# EAGLE design synth-zodiac-leo-power (EAGLE 9.6.2)
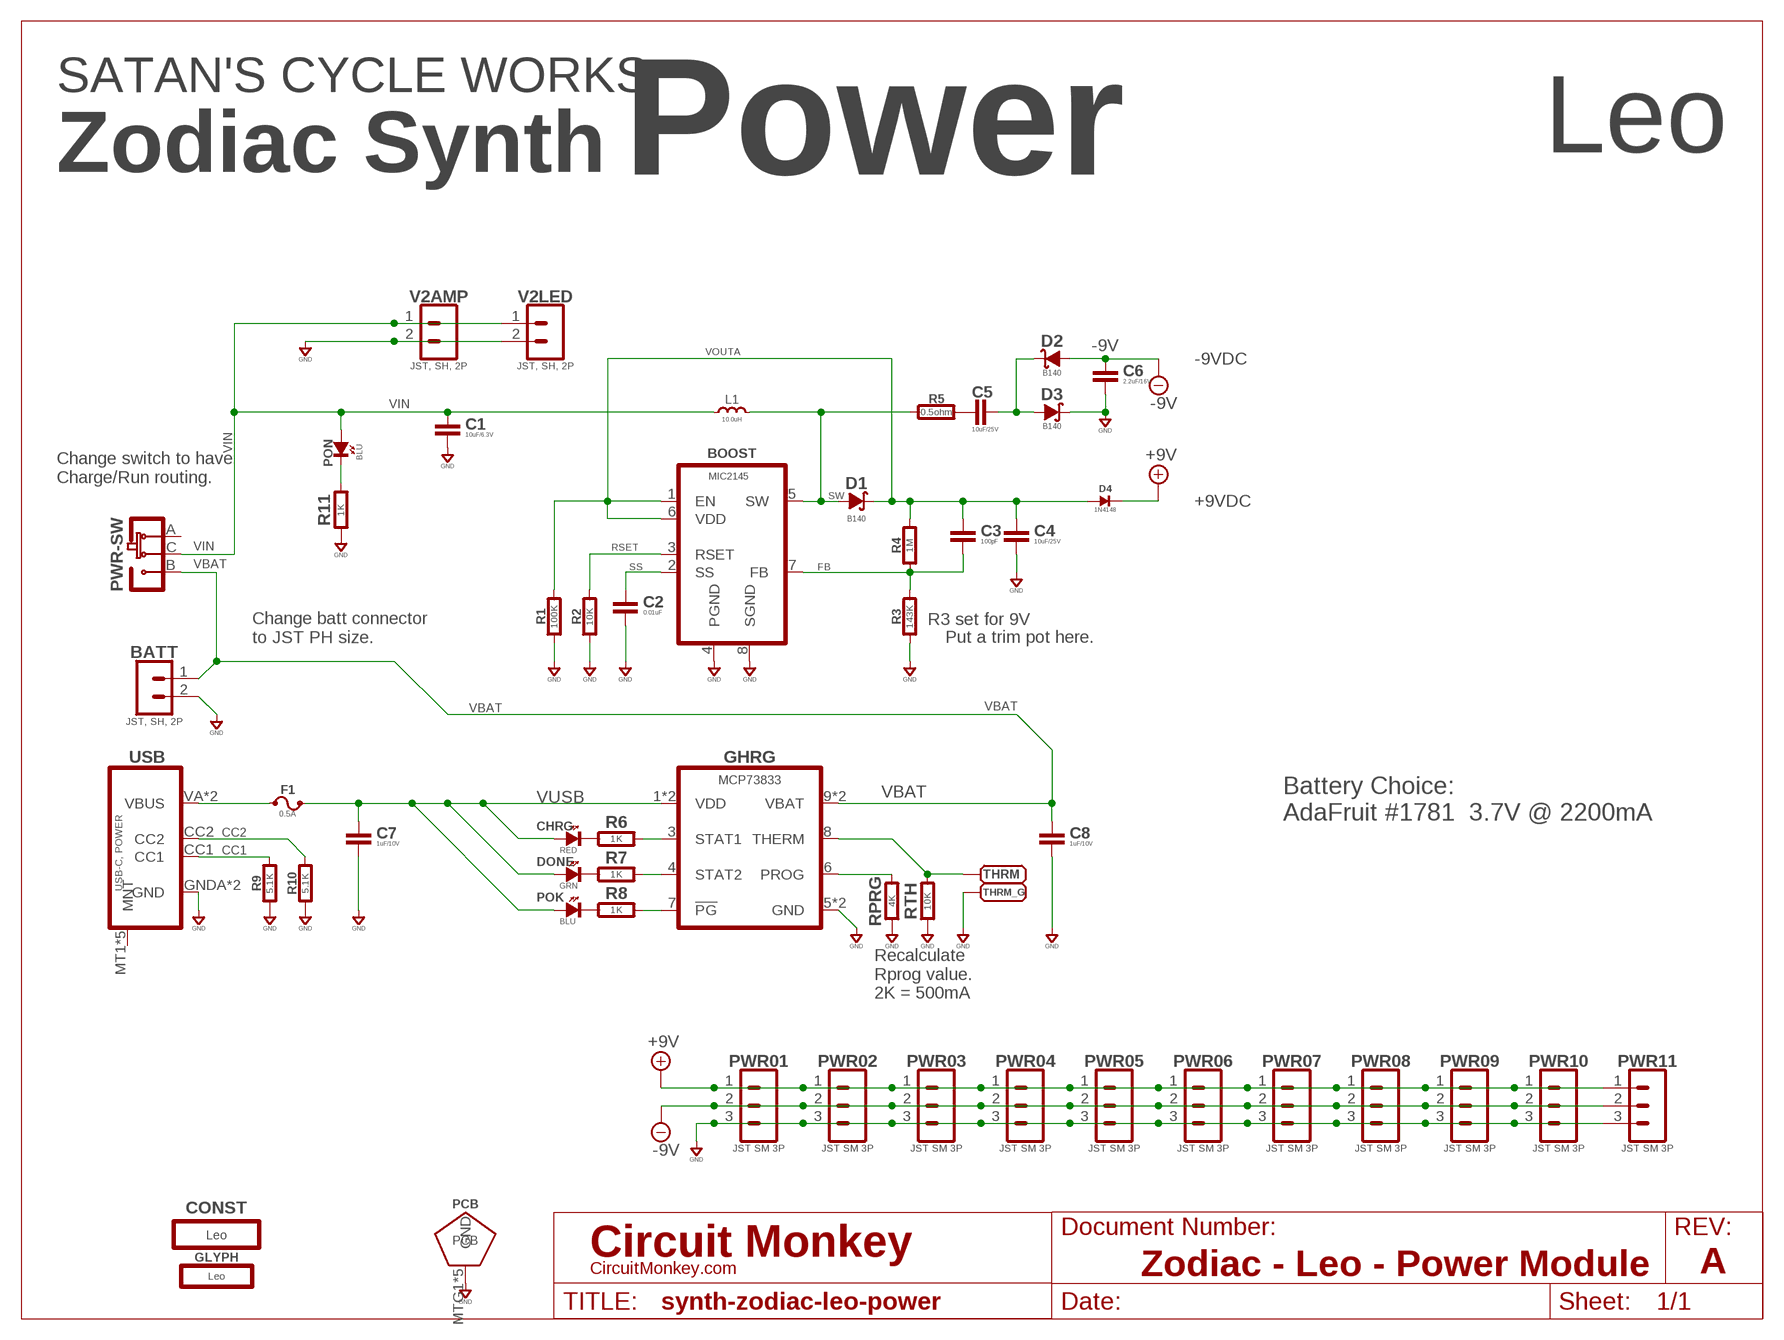
[diagram p0: schematic, sheet 1]
U$1 (LETTER_L-CIRCUITMONKEY): DOCUMENT_NUMBER: Zodiac - Leo - Power Module; REV: A

## Parts
BATT  JST, SH, 2P  02P-SM-VT-SMT  [BM02B-SRSS-TB]
BOOST  MIC2145  BOOST-MIC2145-MSOP  [MSOP8-0.65]
C1  10uF/6.3V  CAPACITOR0603  [0603-CAP]
C2  0.01uF  CAPACITOR0603  [0603-CAP]
C3  100pF  CAPACITOR0603  [0603-CAP]
C4  10uF/25V  CAPACITOR0603  [0603-CAP]
C5  10uF/25V  CAPACITOR0603  [0603-CAP]
C6  2.2uF/16V  CAPACITOR0603  [0603-CAP]
C7  1uF/10V  CAPACITOR0603  [0603-CAP]
C8  1uF/10V  CAPACITOR0603  [0603-CAP]
CHRG  RED  SMT0603  [SMD_0603]
CONST  Leo  CONSTELLATION-LEO  [LEO-CONST]
D1  B140  SCHOTTKYB140  [SMA]
D2  B140  SCHOTTKYB140  [SMA]
D3  B140  SCHOTTKYB140  [SMA]
D4  1N4148  DIODE-1N4148  [SOD-123]
DONE  GRN  SMT0603  [SMD_0603]
F1  0.5A  FUSEBOURNS-MF-MSMF  [BOURNS-MF-MSMF]
GHRG  MCP73833  MCP73833-DFN  [DFN-10-3X3]
GLYPH  Leo  GLYPH-LEO  [LEO-GLYPH]
L1  10.0uH  INDUCTORSMD-05X04MM  [IND-SRN5040]
PCB  PCB FAB  PENTAGON-40R  [PENTAGON-40MM-RAD]
POK  BLU  SMT0603  [SMD_0603]
PON  BLU  SMT0603  [SMD_0603]
PWR  SLIDE-SPDT-MNTSS-12-F45-TH-PCB-2  [SS-12-F45-PNL-SMT-2]
PWR01  JST SM 3P  03P-SM-VT-SMT  [BM03B-SRSS-TB]
PWR02  JST SM 3P  03P-SM-VT-SMT  [BM03B-SRSS-TB]
PWR03  JST SM 3P  03P-SM-VT-SMT  [BM03B-SRSS-TB]
PWR04  JST SM 3P  03P-SM-VT-SMT  [BM03B-SRSS-TB]
PWR05  JST SM 3P  03P-SM-VT-SMT  [BM03B-SRSS-TB]
PWR06  JST SM 3P  03P-SM-VT-SMT  [BM03B-SRSS-TB]
PWR07  JST SM 3P  03P-SM-VT-SMT  [BM03B-SRSS-TB]
PWR08  JST SM 3P  03P-SM-VT-SMT  [BM03B-SRSS-TB]
PWR09  JST SM 3P  03P-SM-VT-SMT  [BM03B-SRSS-TB]
PWR10  JST SM 3P  03P-SM-VT-SMT  [BM03B-SRSS-TB]
PWR11  JST SM 3P  03P-SM-VT-SMT  [BM03B-SRSS-TB]
R1  100K  RESISTOR0603  [0603-RES]
R2  10K  RESISTOR0603  [0603-RES]
R3  143K  RESISTOR0603  [0603-RES]
R4  1M  RESISTOR0603  [0603-RES]
R5  0.5ohm  RESISTOR0603  [0603-RES]
R6  1K  RESISTOR0603  [0603-RES]
R7  1K  RESISTOR0603  [0603-RES]
R8  1K  RESISTOR0603  [0603-RES]
R9  5.1K  RESISTOR0603  [0603-RES]
R10  5.1K  RESISTOR0603  [0603-RES]
R11  1K  RESISTOR0603  [0603-RES]
RPRG  4K  RESISTOR0603  [0603-RES]
RTH  10K  RESISTOR0603  [0603-RES]
THRM  PADSMD-050X050  [SMD-050X050]
THRM_G  PADSMD-050X050  [SMD-050X050]
USB  USB-C, POWER  USB-C-PWRGCT-4515  [GCT-USB4515-PANEL]
V2AMP  JST, SH, 2P  02P-SM-VT-SMT  [BM02B-SRSS-TB]
V2LED  JST, SH, 2P  02P-SM-VT-SMT  [BM02B-SRSS-TB]

## Nets
+9V: D4.K PWR01.1 PWR02.1 PWR03.1 PWR04.1 PWR05.1 PWR06.1 PWR07.1 PWR08.1 PWR09.1 PWR10.1 PWR11.1
-9V: C6.1 D2.A PWR01.2 PWR02.2 PWR03.2 PWR04.2 PWR05.2 PWR06.2 PWR07.2 PWR08.2 PWR09.2 PWR10.2 PWR11.2
CC1: R9.2 USB.CC1
CC2: R10.2 USB.CC2
FB: BOOST.7(FB) C3.2 R3.2 R4.1
GND: BATT.2 BOOST.4(PGND) BOOST.8(SGND) C1.2 C2.2 C4.2 C6.2 C7.2 C8.2 D3.K GHRG.5(GND) GHRG.PAD(GND) PCB.MTG1(GND) PCB.MTG2(GND) PCB.MTG3(GND) PCB.MTG4(GND) PCB.MTG5(GND) PWR01.3 PWR02.3 PWR03.3 PWR04.3 PWR05.3 PWR06.3 PWR07.3 PWR08.3 PWR09.3 PWR10.3 PWR11.3 R1.1 R2.1 R3.1 R9.1 R10.1 R11.1 RPRG.1 RTH.1 THRM_G.1(PAD) USB.GNDA(GND) USB.GNDB(GND) V2AMP.2 V2LED.2
N$1: C5.1 R5.2
N$2: C5.2 D2.K D3.A
N$3: CHRG.K(C) R6.1
N$4: PON.K(C) R11.2
N$5: DONE.K(C) R7.1
N$7: POK.K(C) R8.1
N$8: GHRG.6(PROG) RPRG.2
N$9: GHRG.3(STAT1) R6.2
N$10: GHRG.4(STAT2) R7.2
N$11: GHRG.7(!PG) R8.2
N$12: GHRG.8(THERM) RTH.2 THRM.1(PAD)
RSET: BOOST.3(RSET) R2.2
SS: BOOST.2(SS) C2.1
SW: BOOST.5(SW) D1.A L1.1 R5.1
VBAT: BATT.1 C8.1 GHRG.9(VBAT) GHRG.10(VBAT) PWR.B(-SW:B)
VBUS: F1.1 USB.VA(VBUS) USB.VB(VBUS)
VIN: C1.1 L1.2 PON.A PWR.C(-SW:C) V2AMP.1 V2LED.1
VOUTA: BOOST.1(EN) BOOST.6(VDD) C3.1 C4.1 D1.K D4.A R1.2 R4.2
VUSB: C7.1 CHRG.A DONE.A F1.2 GHRG.1(VDD) GHRG.2(VDD) POK.A
Unconnected: PWR.A(-SW:A) PWR.MTG1(-MTG:MT1) PWR.MTG2(-MTG:MT2) PWR.MTG3(-MTG:MT1) PWR.MTG4(-MTG:MT2) USB.MT1(MNT) USB.MT2(MNT) USB.MT3(MNT) USB.MT4(MNT) USB.MTC(MNT)

## Notes on the sheet
- Power | Leo
- SATAN'S CYCLE WORKS
- Zodiac Synth
- -9VDC
- Change switch to have 
  Charge/Run routing.
- +9VDC
- R3 set for 9V
- Change batt connector
  to JST PH size.
- Put a trim pot here.
- Battery Choice:
  AdaFruit #1781  3.7V @ 2200mA
- Recalculate
  Rprog value.
  2K = 500mA

## Library data of the parts
BATT V2AMP V2LED = con-jst:02P: 2 pin connector; COST01: 0.45; COST10: 0.4; COST100: 0.35; MFR: JST; MPN: BMB02B-SRSS-TB
BOOST = regulators:BOOST-MIC2145: Micrel 2145 Boost Converter; COST01: 2.75; COST10: 2.71; COST100: 2.70; MFR: Micrel; MPN: MIC2145YMM
C1-C8 = rlc:CAPACITOR: Capacitor; COST01: 0.12; COST10: 0.09; COST100: 0.05
CHRG DONE POK PON = led:SMT: LED SMT; COST01: 0.20; COST10: 0.17; COST100: 0.14
CONST = circuit-monkey-zodiac:CONSTELLATION: Constellations
D1-D3 = diodes:SCHOTTKY: Schottky Diodes; COST01: 0.38; COST10: 0.28; COST100: 0.18; MFR: Vishay/Various; MPN: B140
D4 = diodes:DIODE-: Diode; COST01: 0.20; COST10: 0.18; COST100: 0.10; MPN: 1N4148W
F1 = fuse:FUSE: Fuse; COST01: 0.75; COST10: 0.60; COST100: 0.50; MFR: BOURNS; MPN: MF-MSMF*
GHRG = co-microchip:MCP73833: USB Charger for Li-Ion Battery cell.; MFR: Microchip; MPN: MCP73833-AMI/MF
GLYPH = circuit-monkey-zodiac:GLYPH: Glyph
L1 = rlc:INDUCTOR: Inductor; COST01: 0.55; COST10: 0.40; COST100: 0.35; MFR: Bourns; MPN: SRN5040
PCB = circuit-monkey-zodiac:PENTAGON: Pentagram shaped PCB
PWR = switch-thd:SLIDE-SPDT-MNT: Slide Switch, SPDT; COST01: 0.15; COST10: 0.12; COST100: 0.12; MFR: Tayda; MPN: A-659/A-5111/A-5104
PWR01-PWR09 PWR10 PWR11 = con-jst:03P: 3 pin connector; COST01: 0.60; COST10: 0.45; COST100: 0.38; MFR: JST; MPN: BM03B-SRSS-TB
R1-R11 RPRG RTH = rlc:RESISTOR: Resistor; COST01: 0.10; COST10: 0.05; COST100: 0.02
THRM THRM_G = con-testpoints:PAD: Solder Pad
USB = con-usb:USB-C-PWR: USB-C, Power Only; COST01: 0.70; COST10: 0.55; COST100: 0.45; MFR: GCT; MPN: USB4515

## Net classes
0 default: width 0.152 mm, clearance 0.152 mm
2 gnd: width 0.203 mm, drill 0.33 mm, clearance 0.152 mm

## Board
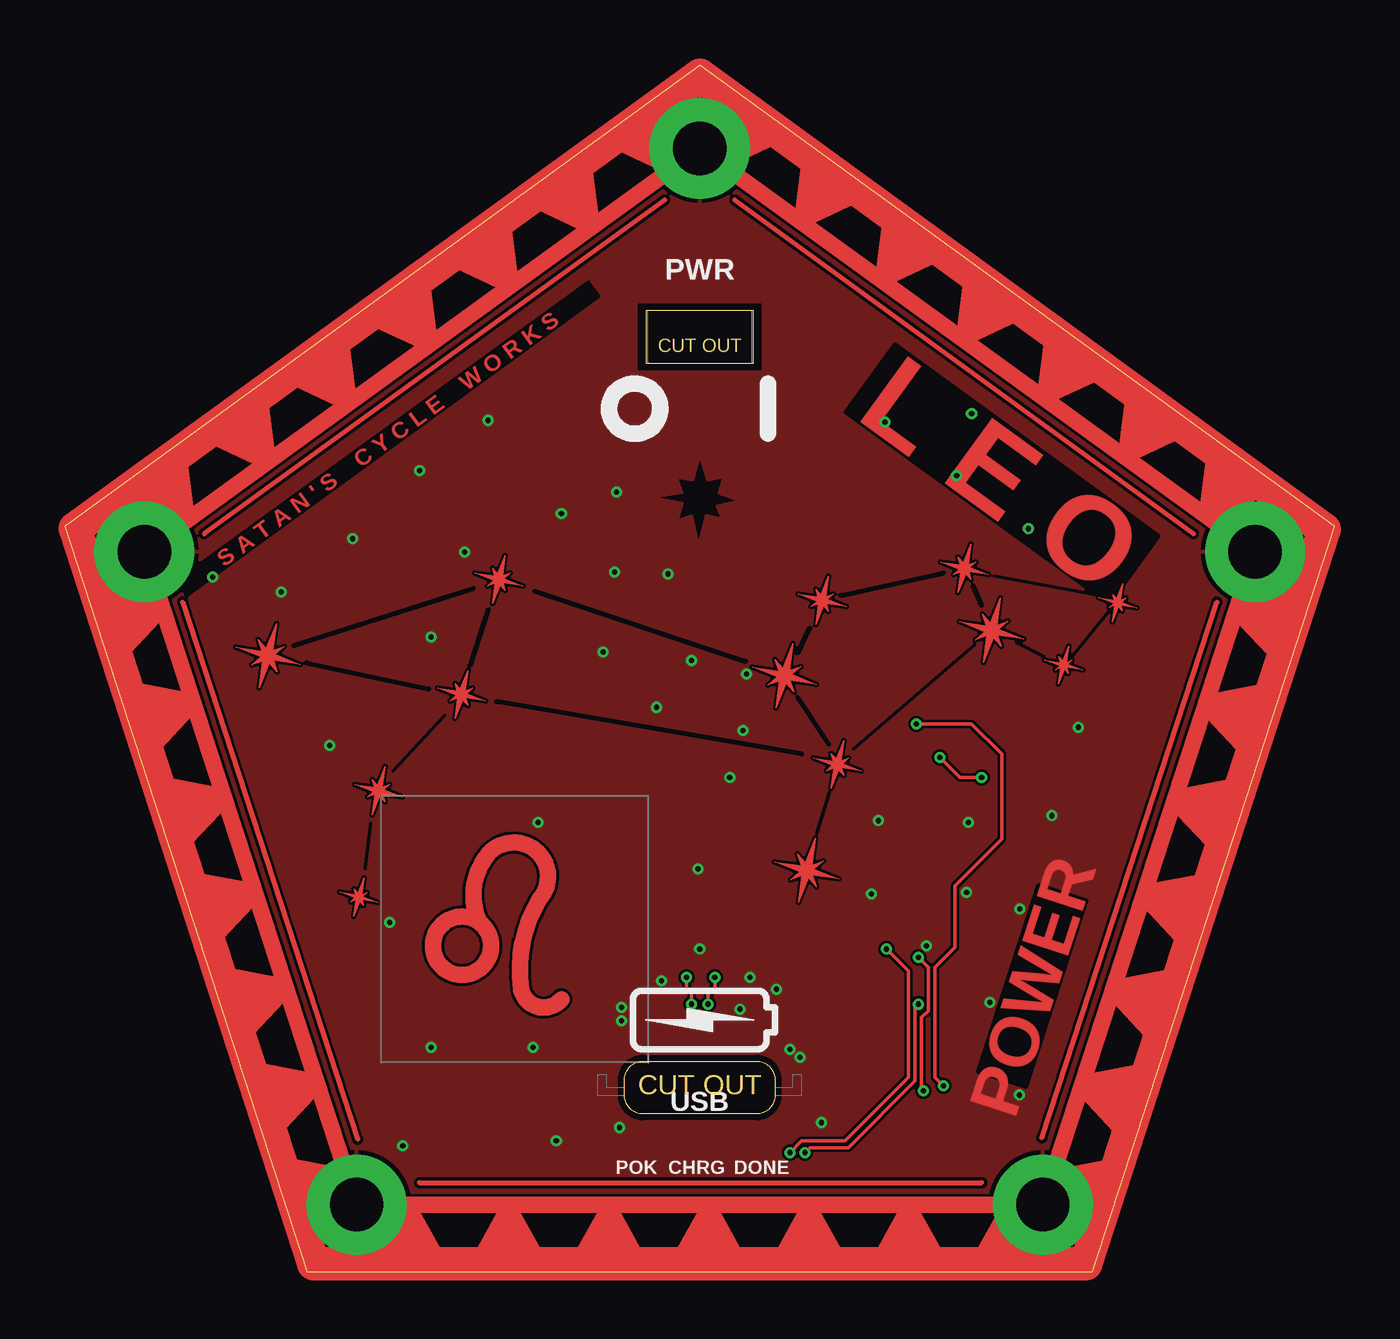
[diagram p1: board, top side]
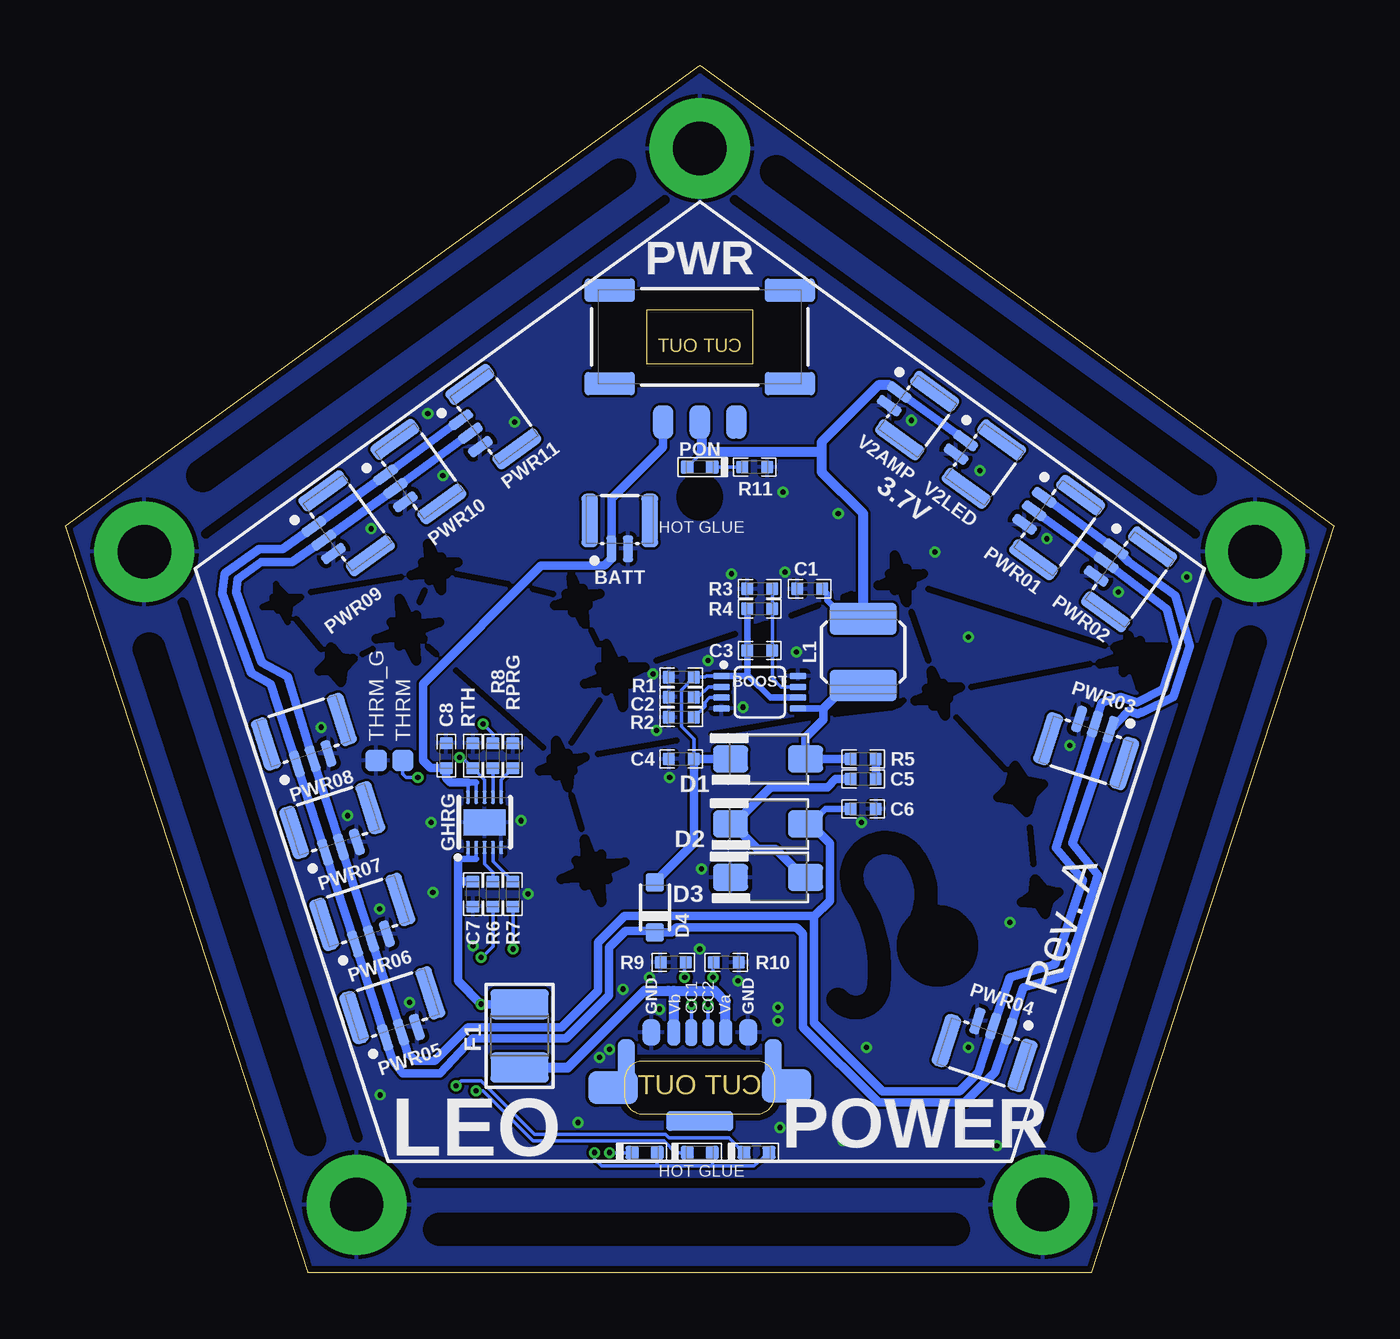
[diagram p2: board, bottom side, seen from below]

Size 76.08 x 72.36 mm. Coordinates in mm from the lower left corner, seen from the top.
Copper layers (1*16): Top 0.0356mm / dielectric 1.5011mm / Bottom 0.0356mm
Design rules "OSH-CircuitMonkey *": minimum track width 6mil, minimum drill 12mil, track to track 6mil, track to pad 6mil, pad to pad 6mil, via to via 6mil, smd to smd 6mil, copper to edge 15mil, drill to drill 6mil, minimum pad ring 7mil, minimum via ring 7mil, stop-mask expansion 3mil, vias tented up to drill 13mil, thermal gap 10mil
tRestrict: area 35.6,44 to 40.1,48.7
bRestrict: area 61.9,39 to 64.2,41.3; area 58.8,35.4 to 60.8,37.5; area 53.6,36.7 to 57.4,40.4; area 52.5,40.9 to 55.3,43.7; area 44,38.9 to 46.7,41.7; area 41.3,33.9 to 44.9,37.7; area 44.9,29.1 to 47.6,31.9; area 42.5,22.2 to 46.3,26; area 22.4,33.4 to 25.1,36.1; area 24.6,40.2 to 27.3,43; area 10.2,35.1 to 14,38.2; area 17.4,27.6 to 20.1,30.4; area 16.5,21.5 to 18.7,23.6; area 36.6,45.1 to 39.4,47.9; 26 lines

### Footprints (pad centres in the part's own frame; a part is rotated, then mirrored left to right if it is on the bottom)
BM02B-SRSS-TB = smd 0.6 x 1.6: 1 -0.5,-0.3; 2 0.5,-0.3 | smd 1 x 3.2: MTG1 1.8,1.4; MTG2 -1.8,1.4
MSOP8-0.65 = smd 1 x 0.4: 1 -2.3,0.975; 2 -2.3,0.325; 3 -2.3,-0.325; 4 -2.3,-0.975; 5 2.3,-0.975; 6 2.3,-0.325; 7 2.3,0.325; 8 2.3,0.975
0603-CAP = smd 0.711 x 0.762: 1 -0.752,0; 2 0.752,0
SMD_0603 = smd 0.8 x 0.8: A 0.75,0; K -0.75,0
SMA = smd 2.1 x 1.6: A -2.25,0; K 2.25,0
SOD-123 = smd 1.1 x 1.1: A 1.5,0; K -1.5,0
BOURNS-MF-MSMF = smd 1.8 x 3.5: 1 -1.9,0; 2 1.9,0
DFN-10-3X3 = smd 0.25 x 0.8: 1 -1,-1.5; 2 -0.5,-1.5; 3 0,-1.5; 4 0.5,-1.5; 5 1,-1.5; 6 1,1.5; 7 0.5,1.5; 8 0,1.5; 9 -0.5,1.5; 10 -1,1.5 | smd 2.5 x 1.55: PAD 0,0
IND-SRN5040 = smd 1.9 x 4: 1 -2,0; 2 2,0
PENTAGON-40MM-RAD = drill 3.2 pad 6: MTG1 0,35; MTG2 33.3,10.82; MTG3 20.57,-28.32; MTG4 -20.57,-28.32; MTG5 -33.3,10.82
SS-12-F45-PNL-SMT-2 = smd 1.2 x 2 bottom: A -2.2,-5.1; B 2.2,-5.1; C 0,-5.1 | smd 3 x 1.4 bottom: MTG1 -5.4,2.8; MTG2 5.4,2.8; MTG3 -5.4,-2.8; MTG4 5.4,-2.8
BM03B-SRSS-TB = smd 0.6 x 1.6: 1 -1,-0.3; 2 0,-0.3; 3 1,-0.3 | smd 1 x 3.2: MTG1 2.4,1.4; MTG2 -2.4,1.4
0603-RES = smd 0.711 x 0.762: 1 -0.752,0; 2 0.752,0
SMD-050X050 = smd 1.27 x 1.27: 1 0.508,0
GCT-USB4515-PANEL = smd 0.7 x 1.6 bottom: CC1 -0.5,-3.3; CC2 0.5,-3.3 | smd 1.1 x 1.6 bottom: GNDA 2.9,-3.3; GNDB -2.9,-3.3 | smd 3 x 2 bottom: MT1 -5.2,0; MT2 5.2,-0.1 | smd 1 x 2.4 bottom: MT3 -4.4,-1.7; MT4 4.4,-1.7 | smd 4 x 1.2 bottom: MTC 0,2 | smd 0.8 x 1.6 bottom: VA 1.55,-3.3; VB -1.55,-3.3

### Placement (x,y rotation side)
BATT  42.84,43.66 0 bottom
BOOST  34.44,34.76 0 bottom
C1  31.44,40.96 180 bottom
C2  39.14,34.46 180 bottom
C3  34.44,37.26 0 bottom
C4  39.14,30.76 180 bottom
C5  28.24,29.56 180 bottom
C6  28.24,27.76 0 bottom
C7  51.64,22.66 270 bottom
C8  53.24,30.96 90 bottom
CHRG  38.04,7.16 0 bottom
CONST  36.04,34.36 345 top
D1  33.94,30.76 180 bottom
D2  33.94,26.86 180 bottom
D3  33.94,23.66 180 bottom
D4  40.74,21.86 90 bottom
DONE  41.34,7.16 0 bottom
F1  48.84,14.16 90 bottom
GHRG  50.94,26.96 0 bottom
GLYPH  27.04,20.56 0 top
L1  28.24,37.16 90 bottom
PCB  38.04,32.36 0 top
POK  34.64,7.16 0 bottom
PON  38.04,48.26 180 bottom
PWR  38.04,56.06 0 top
PWR01  17.74,45.46 234 bottom
PWR02  13.44,42.36 234 bottom
PWR03  14.44,32.56 162 bottom
PWR04  20.54,14.46 162 bottom
PWR05  56.04,14.66 18 bottom
PWR06  57.84,20.26 18 bottom
PWR07  59.64,25.76 18 bottom
PWR08  61.34,31.06 18 bottom
PWR09  60.34,44.06 306 bottom
PWR10  56.04,47.16 306 bottom
PWR11  51.54,50.46 306 bottom
R1  39.14,35.66 0 bottom
R2  39.14,33.26 0 bottom
R3  34.44,40.96 0 bottom
R4  34.44,39.76 180 bottom
R5  28.24,30.76 0 bottom
R6  50.44,22.66 90 bottom
R7  49.24,22.66 90 bottom
R8  50.44,30.96 270 bottom
R9  39.64,18.56 0 bottom
R10  36.44,18.56 180 bottom
R11  34.74,48.26 180 bottom
RPRG  49.24,30.96 270 bottom
RTH  51.64,30.96 270 bottom
THRM  55.84,30.16 90 bottom
THRM_G  57.44,30.16 90 bottom
USB  38.04,11.06 180 top
V2AMP  26.14,52.16 234 bottom
V2LED  22.14,49.26 234 bottom

### Tracks (layer width: path | path; a pad name or v marks a point on that pad's centre or on a via)
+9V
  Bottom 0.5: PWR01.1 17.36,46.45 13.16,43.34 PWR02.1 12.32,42.56 9.54,40.56 8.65,37.53 9.64,34.46 11.54,33.56 11.57,33.56 11.77,33.46 11.78,33.46 11.79,33.46 12.04,33.54 12.35,33.63 PWR03.1 15.71,25.69 14.17,23.82 15.44,19.86 16.14,17.76 18.64,17.06 PWR04.1 20.34,11.96 22.14,10.16 27.34,10.16 31.84,14.66 31.84,20.26 32.24,20.66 39.44,20.66 39.74,20.36 D4.K 40.84,20.46 42.49,20.46 43.49,19.46 43.49,16.59 46.07,14.01 51.67,14.01 53.62,11.92 55.85,11.92 56.46,12.68 PWR05.1 PWR06.1 PWR07.1 PWR08.1 63.76,35.25 64.94,35.91 66.67,40.69 66.53,41.88 64.47,43.34 63.04,43.34 PWR09.1 61.19,44.68 PWR10.1 56.84,47.82 PWR11.1
-9V
  Bottom 0.4: D2.A 31.39,26.86 30.49,27.76 C6.1
  Bottom 0.5: PWR01.2 PWR02.2 | PWR02.2 | PWR02.2 10.04,39.76 9.64,38.26 9.44,37.46 10.24,34.96 11.84,34.16 12.84,34.46 13.94,34.16 PWR03.2 16.69,25.43 15.08,23.52 16.75,18.44 19.44,17.66 PWR04.2 21.34,11.96 22.48,10.82 27.08,10.82 31.19,14.93 31.19,15.01 31.19,21.31 | PWR11.2 55.95,47.23 PWR10.2 60.6,43.89 PWR09.2 62.47,42.56 64.34,42.56 65.74,41.56 65.84,40.76 64.3,36.53 62.75,35.7 PWR08.2 PWR07.2 PWR06.2 PWR05.2 55.56,13.12 55.04,12.66 53.94,12.66 51.94,14.66 46.34,14.66 44.14,16.86 44.14,19.76 42.54,21.36 31.19,21.36 31.19,21.31 | 31.39,26.86 30.24,25.71 30.24,22.26 31.19,21.31
CC1  (via drill 0.3)
  Top 0.2: v38.54,16.06 38.54,16.66 38.94,17.06 v38.94,17.66
  Bottom 0.2: v38.94,17.66 38.94,18.51 R9.2 | USB.CC1 v38.54,16.06
CC2  (via drill 0.3)
  Top 0.2: v37.24,17.66 37.24,17.06 37.54,16.76 v37.54,16.06
  Bottom 0.2: v37.24,17.66 37.24,18.51 R10.2 | USB.CC2 v37.54,16.06
FB
  Bottom 0.2: R3.2 R4.1 C3.2 33.69,35.61 33.17,35.09 BOOST.7
GND  (via drill 0.3)
  other vias: 42.64,16.96 44.04,12.86 29.44,7.86 33.34,15.06 45.34,8.96 33.24,8.66 57.19,10.61 20.24,7.56 28.04,13.46 19.44,20.96 8.84,41.66 23.94,43.16 21.94,38.06 29.74,45.46 54.34,51.46 59.14,27.36 54.14,26.96 41.04,17.66 35.74,17.46 37.94,24.16 38.04,19.36 32.94,41.96 36.14,41.86 40.64,32.46 40.84,35.86 35.44,33.86 32.24,37.16 28.34,26.96 33.04,46.76 37.54,36.66 39.84,29.66 60.74,32.66 57.24,21.76 55.44,16.16 12.94,40.76 17.24,43.96 21.24,48.06 25.34,51.06 49.14,50.96 53.44,47.76 57.74,44.56 15.84,31.56 21.94,13.46 51.64,19.56 48.34,22.66 54.04,22.76 48.74,27.06 43.44,13.36 40.44,15.76 33.34,15.86
  pour Top (rank 4): 17.54,4.36 58.54,4.36 71.04,42.86 38.04,66.86 5.04,42.86
  pour Bottom: 14.64,0.06 61.44,0.06 75.94,44.66 38.04,72.26 0.22,44.72
N$1
  Bottom 0.5: R5.2 C5.1
N$2
  Bottom 0.5: D3.A 31.79,23.66 33.49,25.36 34.59,25.36 36.09,26.86 D2.K 35.99,26.86 33.79,29.06 30.39,29.06 29.89,29.56 C5.2
N$3  (via drill 0.3)
  Top 0.2: v51.44,10.86 51.34,10.96 51.34,15.26 51.74,15.66 51.74,18.26 v51.14,18.86
  Bottom 0.2: v51.14,18.86 51.09,18.86 50.44,19.51 R6.1 | CHRG.K 39.49,7.16 40.19,7.86 48.04,7.86 51.04,10.86 v51.44,10.86
N$4
  Bottom 0.2: PON.K R11.2
N$5  (via drill 0.3)
  Top 0.2: v49.24,19.36 50.54,18.06 50.54,11.66 46.74,7.86 44.14,7.86 v43.44,7.16
  Bottom 0.2: R7.1 v49.24,19.36 | DONE.K v43.44,7.16
N$7  (via drill 0.3)
  Top 0.2: v51.04,32.86 54.34,32.86 56.14,31.06 56.14,25.96 53.34,23.16 53.34,19.46 52.14,18.26 52.14,11.66 v52.64,11.16
  Bottom 0.2: R8.1 50.44,32.26 v51.04,32.86 | POK.K 36.29,8.06 39.87,8.06 40.09,8.26 47.94,8.26 51.14,11.46 52.34,11.46 v52.64,11.16
N$8
  Bottom 0.2: GHRG.6 49.94,29.51 RPRG.2
N$9
  Bottom 0.2: GHRG.3 50.94,24.46 50.44,23.96 R6.2
N$10
  Bottom 0.2: GHRG.4 50.44,24.61 R7.2
N$11
  Bottom 0.2: GHRG.7 R8.2
N$12  (via drill 0.3)
  Top 0.2: v52.44,30.86 53.64,29.66 v54.94,29.66
  Bottom 0.2: THRM.1 55.84,29.86 55.64,29.66 v54.94,29.66 | v52.44,30.86 52.29,30.86 RTH.2 50.94,29.51 GHRG.8
RSET
  Bottom 0.2: R2.2 37.74,33.91 37.74,34.16 37.47,34.44 BOOST.3
SS
  Bottom 0.2: BOOST.2 37.52,35.09 38.14,34.46 C2.1
SW
  Bottom 0.4: BOOST.5 30.62,33.79 | 29.24,35.16 L1.1
  Bottom 0.5: 29.24,35.16 30.62,33.79 30.62,33.14 31.69,32.06 D1.A R5.1
VBAT
  Bottom 0.2: GHRG.10 51.94,29.36 | GHRG.9 51.44,29.36
  Bottom 0.4: 51.44,29.36 51.94,29.36
  Bottom 0.5: 51.94,29.36 52.99,29.36 53.24,29.61 C8.1 54.19,30.21 54.64,30.66 54.64,35.26 47.54,42.36 43.74,42.36 43.34,42.76 BATT.1 43.34,46.36 40.24,49.46 PWR.B
VBUS
  Bottom 0.6: 39.59,16.86 39.94,16.86 41.35,16.86 45.95,12.26 F1.1 | 39.59,16.86 37.14,16.86 36.49,16.21 USB.VA | USB.VB 39.59,16.86
VIN
  Bottom 0.2: PON.A 37.94,49.11 37.94,49.16
  Bottom 0.4: C1.1 30.39,40.66 30.39,40.26 29.29,39.16 L1.2
  Bottom 0.5: V2AMP.1 V2LED.1
  Bottom 0.6: V2AMP.1 26.64,53.16 27.33,53.16 30.74,49.75 30.74,49.16 | L1.2 28.24,45.46 30.74,47.96 30.74,49.16 | PWR.C 37.94,50.86 37.94,49.16 30.74,49.16
VOUTA
  Bottom 0.2: BOOST.1 37.64,35.74 37.72,35.66 R1.2 39.14,34.91 39.14,32.71 38.39,31.96 C4.1
  Bottom 0.4: BOOST.1 35.12,35.74 | BOOST.6 33.82,34.44 35.12,35.74 | 35.12,35.74 35.19,35.81 C3.1 R4.2
  Bottom 0.5: D1.K C4.1 38.39,25.71 D4.A
VUSB  (via drill 0.3)
  Top 0.2: v44.34,7.16 44.64,7.46 46.94,7.46 50.94,11.46 50.94,15.86 v51.14,16.06
  Bottom 0.2: 51.94,24.76 GHRG.1 | GHRG.2 51.44,24.76 | v44.34,7.16 44.34,6.76 43.94,6.36 40.59,6.36 | DONE.A 40.59,6.36 | 40.59,6.36 37.29,6.36 | CHRG.A 37.29,6.36 | POK.A 33.9,7.16 34.8,6.36 37.29,6.36
  Bottom 0.4: 51.44,24.76 51.94,24.76 52.54,24.76
  Bottom 0.5: 52.54,24.76 52.54,23.41 | C7.1 52.54,23.41 | F1.2 v51.14,16.06 52.54,17.46 52.54,23.41

### Text on the board
Top: S A T A N ' S C Y C L E W O R K S | L E O | POWER
bPlace: 3.7V | HOT GLUE | Rev. A | POWER | LEO | HOT GLUE
tStop: S A T A N ' S C Y C L E W O R K S | L E O | POWER